# EAGLE design attiny45-microcontrol (EAGLE 6.4)
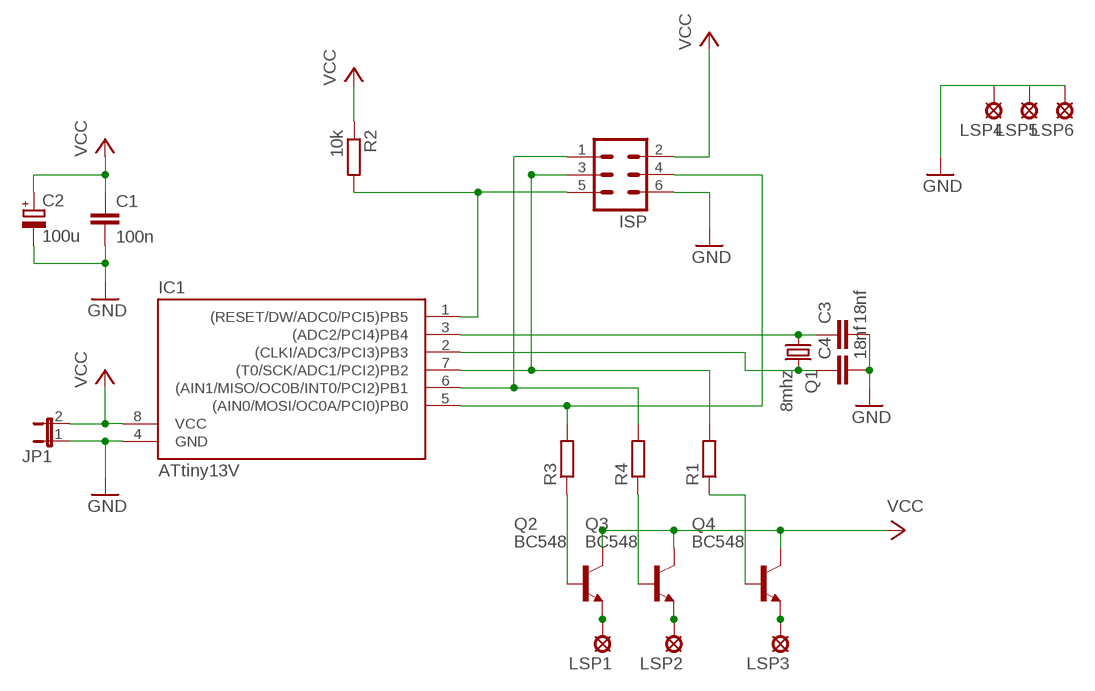
[diagram p0: schematic, sheet 1]

## Parts
C1  100n  C-EU025-025X050  [C025-025X050]
C2  100u  CPOL-EUE2,5-6E  [E2,5-6E]
C3  18nf  C5/2.5  [C5B2.5]
C4  18nf  C5/2.5  [C5B2.5]
IC1  ATtiny13V  ATTINY13-20P  [DIL08]
ISP  MA03-2  [MA03-2]
JP1  JP1E  [JP1]
LSP1  LSP10  [LSP10]
LSP2  LSP10  [LSP10]
LSP3  LSP10  [LSP10]
LSP4  LSP10  [LSP10]
LSP5  LSP10  [LSP10]
LSP6  LSP10  [LSP10]
Q1  8mhz  CRYSTALHC18U-V  [HC18U-V]
Q2  BC548  [TO92-EBC]
Q3  BC548  [TO92-EBC]
Q4  BC548  [TO92-EBC]
R1  R-EU_0204/5  [0204/5]
R2  10k  R-EU_0204/7  [0204/7]
R3  R-EU_0204/5  [0204/5]
R4  R-EU_0204/5  [0204/5]

## Nets
GND: C1.2 C2.- C3.2 C4.2 IC1.4(GND) ISP.6 JP1.1 LSP4.MP LSP5.MP LSP6.MP
N$1: Q2.B R3.1
N$2: C4.1 IC1.2((CLKI/ADC3/PCI3)PB3) Q1.2
N$3: IC1.1((RESET/DW/ADC0/PCI5)PB5) ISP.5 R2.2
N$4: Q3.B R4.1
N$5: IC1.7((T0/SCK/ADC1/PCI2)PB2) ISP.3 R1.2
N$6: IC1.6((AIN1/MISO/OC0B/INT0/PCI2)PB1) ISP.1 R4.2
N$7: Q4.B R1.1
N$8: C3.1 IC1.3((ADC2/PCI4)PB4) Q1.1
N$10: IC1.5((AIN0/MOSI/OC0A/PCI0)PB0) ISP.4 R3.2
N$11: LSP1.MP Q2.E
N$12: LSP2.MP Q3.E
N$13: LSP3.MP Q4.E
VCC: C1.1 C2.+ IC1.8(VCC) ISP.2 JP1.2 Q2.C Q3.C Q4.C R2.1

## Library data of the parts
C1 = rcl:C-EU: CAPACITOR, European symbol
C2 = rcl:CPOL-EU: POLARIZED CAPACITOR, European symbol
C3 C4 = capacitor-wima:C: CAPACITOR naming: grid - package width
IC1 = avr:ATTINY13: MICROCONTROLLER 1 Kbytes FLASH 64 bytes EEPROM 64 bytes RAM 4-channel 10 bit ADC
ISP = con-lstb:MA03-2: PIN HEADER
JP1 = jumper:JP1E: JUMPER
LSP1-LSP6 = solpad:LSP10: SOLDER PAD drill 1.0 mm, distributor Buerklin, 12H555
Q1 = crystal:CRYSTAL: CRYSTAL; OC_FARNELL: unknown; OC_NEWARK: unknown
Q2-Q4 = transistor-npn:BC548*: NPN Transistor
R1-R4 = rcl:R-EU_: RESISTOR, European symbol

## Net classes
0 default: clearance 0.355 mm

## Board
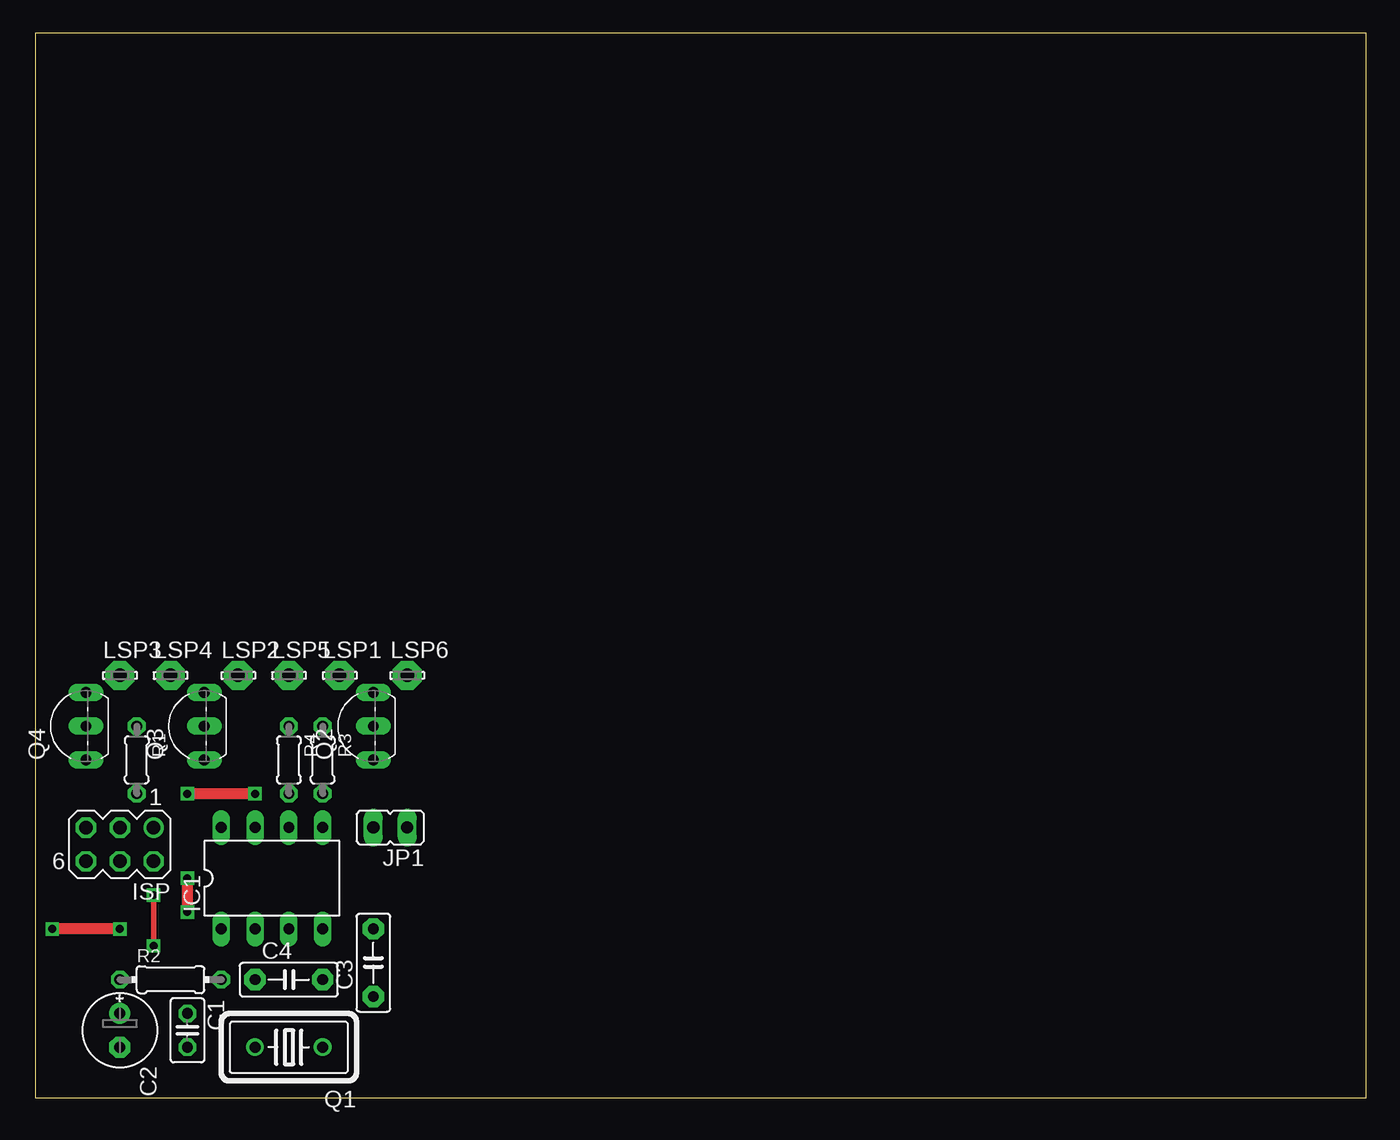
[diagram p1: board, top side]
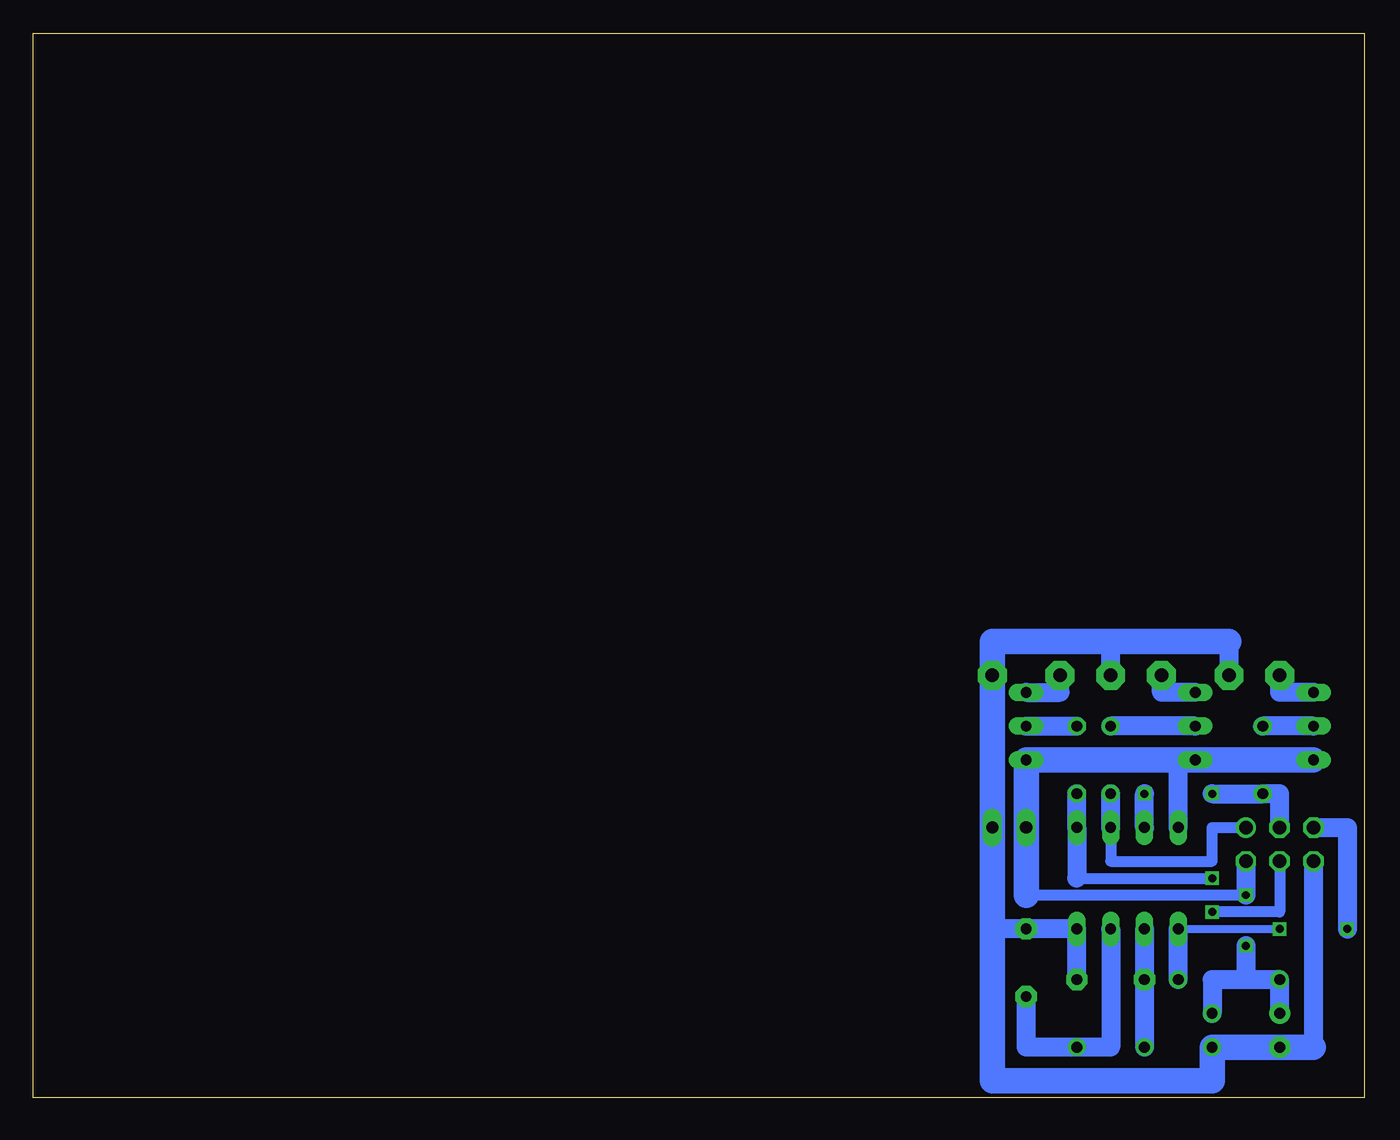
[diagram p2: board, bottom side, seen from below]

Size 100 x 80 mm. Coordinates in mm from the lower left corner, seen from the top.
Outline: 0,0 100,0 100,80 0,80 0,0
Copper layers (1*16): Top 0.035mm / dielectric 1.5mm / Bottom 0.035mm
Design rules "default": minimum track width 10mil, minimum drill 24mil, track to track 8mil, track to pad 8mil, pad to pad 8mil, via to via 8mil, smd to smd 8mil, copper to edge 40mil, drill to drill 8mil, minimum pad ring 10mil, minimum via ring 8mil, stop-mask expansion 4mil, vias tented up to drill 0mil, thermal gap 10mil

### Footprints (pad centres in the part's own frame; a part is rotated, then mirrored left to right if it is on the bottom)
C025-025X050 = drill 0.813 octagon: 1 -1.27,0; 2 1.27,0
E2,5-6E = drill 0.813 pad 1.575: + -1.27,0 | drill 0.813 pad 1.575 octagon: - 1.27,0
C5B2.5 = drill 0.813 pad 1.6 octagon: 1 -2.54,0; 2 2.54,0
DIL08 = drill 0.813 long: 1 -3.81,-3.81; 2 -1.27,-3.81; 3 1.27,-3.81; 4 3.81,-3.81; 5 3.81,3.81; 6 1.27,3.81; 7 -1.27,3.81; 8 -3.81,3.81
MA03-2 = drill 1.016: 1 -2.54,-1.27 | drill 1.016 octagon: 2 -2.54,1.27; 3 0,-1.27; 4 0,1.27; 5 2.54,-1.27; 6 2.54,1.27
JP1 = drill 0.914 long: 1 0,-1.27; 2 0,1.27
LSP10 = drill 1.016 pad 2.159 octagon: MP 0,0
HC18U-V = drill 0.813: 1 -2.54,0; 2 2.54,0
TO92-EBC = drill 0.813 long: B 0,-1.27; C -2.54,-1.27; E 2.54,-1.27
0204/5 = drill 0.813 octagon: 1 -2.54,0; 2 2.54,0
0204/7 = drill 0.813 octagon: 1 -3.81,0; 2 3.81,0

### Placement (x,y rotation side)
C1  11.43,5.08 270 top
C2  6.35,5.08 270 top
C3  25.4,10.16 90 top
C4  19.05,8.89 0 top
IC1  17.78,16.51 0 top
ISP  6.35,19.05 180 top
JP1  26.67,20.32 90 top
LSP1  22.86,31.75 0 top
LSP2  15.24,31.75 0 top
LSP3  6.35,31.75 0 top
LSP4  10.16,31.75 0 top
LSP5  19.05,31.75 0 top
LSP6  27.94,31.75 0 top
Q1  19.05,3.81 180 top
Q2  24.13,27.94 90 top
Q3  11.43,27.94 90 top
Q4  2.54,27.94 90 top
R1  7.62,25.4 270 top
R2  10.16,8.89 0 top
R3  21.59,25.4 270 top
R4  19.05,25.4 270 top

### Tracks (layer width: path | path; a pad name or v marks a point on that pad's centre or on a via)
GND
  Bottom 1.422: C4.2 IC1.4 C3.2 27.94,12.7 | ISP.6 3.81,3.81 | LSP5.MP 19.05,34.29 | 10.16,34.29 LSP4.MP
  Bottom 1.93: 3.81,3.81 C2.- C1.2 11.43,1.27 27.94,1.27 27.94,12.7 JP1.1 LSP6.MP 27.94,34.29 19.05,34.29 10.16,34.29
N$1
  Bottom 1.422: Q2.B R3.1
N$2
  Bottom 1.422: IC1.2 C4.1 Q1.2
N$3  (via drill 0.6)
  Top 0.813: v6.35,12.7 v1.27,12.7
  Bottom 0.6: IC1.1 v6.35,12.7
  Bottom 1.422: R2.2 IC1.1 | ISP.5 1.27,20.32 v1.27,12.7
N$4
  Bottom 1.422: Q3.B R4.1
N$5  (via drill 0.6)
  Top 0.813: v16.51,22.86 v11.43,22.86
  Bottom 1.422: IC1.7 v16.51,22.86 | v11.43,22.86 R1.2 6.35,22.86 ISP.3
N$6
  Bottom 0.813: IC1.6 19.05,17.78 11.43,17.78 11.43,20.32 ISP.1
  Bottom 1.422: IC1.6 R4.2
N$7
  Bottom 1.422: Q4.B R1.1
N$8
  Bottom 1.422: IC1.3 19.05,3.81 Q1.1 25.4,3.81 C3.1
N$10  (via drill 0.6)
  Top 0.813: v11.43,16.51 v11.43,13.97
  Bottom 0.813: ISP.4 6.35,13.97 v11.43,13.97 | 21.59,16.51 v11.43,16.51
  Bottom 1.422: 21.59,16.51 IC1.5 R3.2
N$11
  Bottom 1.422: Q2.E 22.86,30.48 LSP1.MP
N$12
  Bottom 1.422: Q3.E 15.24,30.48 LSP2.MP
N$13
  Bottom 1.422: Q4.E 6.35,30.48 LSP3.MP
N$17  (via drill 0.6)
  other vias: 11.43,16.51
VCC  (via drill 0.6)
  Top 0.4: v8.89,15.24 v8.89,11.43
  Bottom 0.813: v8.89,15.24 25.4,15.24
  Bottom 1.422: 8.89,8.89 R2.1 C2.+ | 8.89,8.89 11.43,8.89 C1.1 | ISP.2 v8.89,15.24 | v8.89,11.43 8.89,8.89 | IC1.8 13.97,25.4
  Bottom 1.93: Q4.C Q3.C 13.97,25.4 Q2.C JP1.2 25.4,15.24